# EAGLE design DCMv3 (EAGLE 9.4.2)
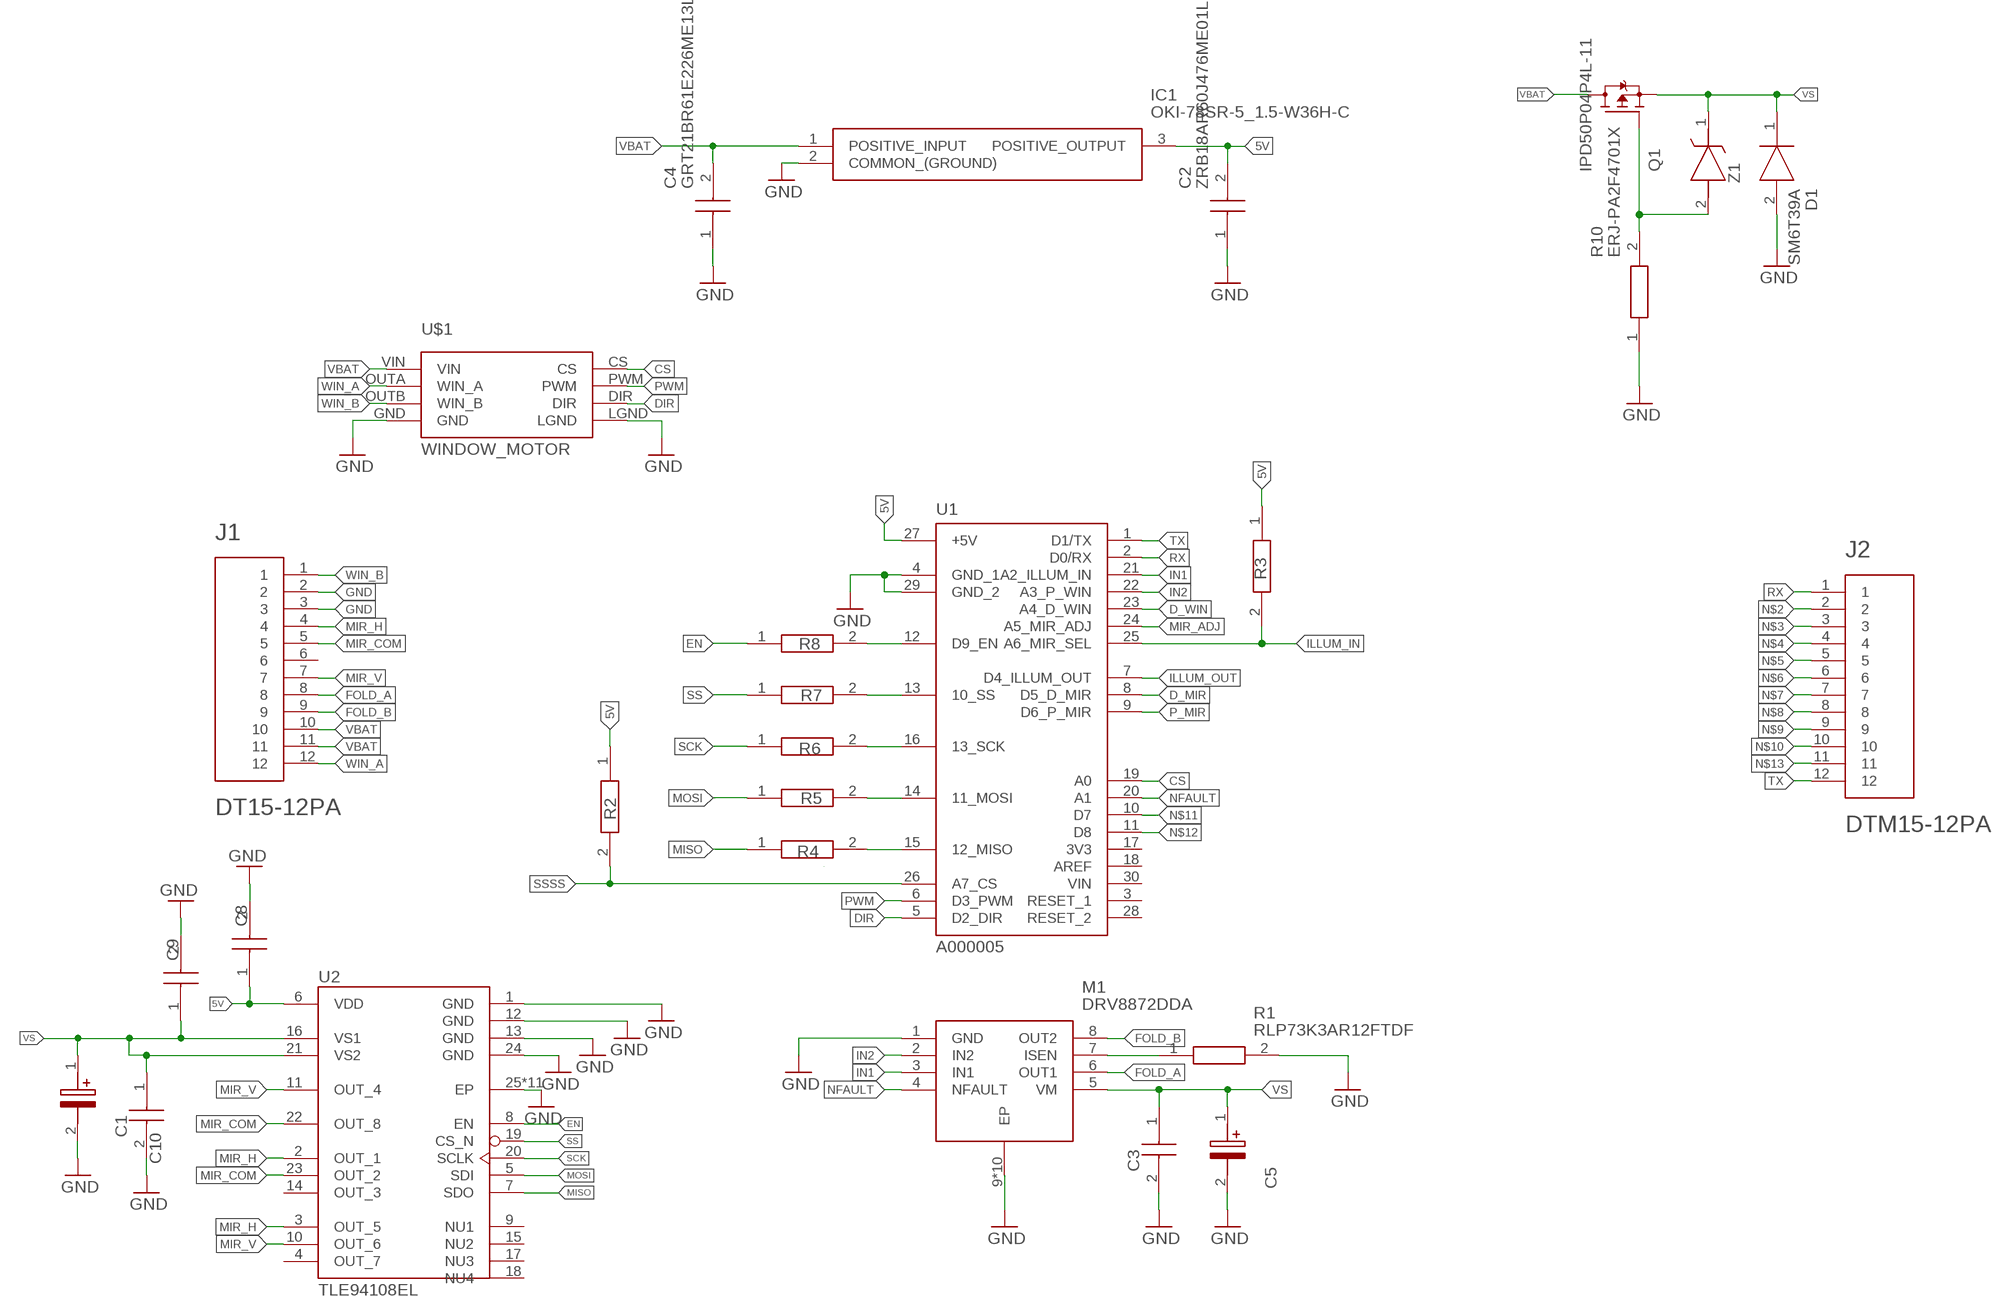
[diagram p0: schematic, sheet 1]

## Parts
C1  EEE-FT1H470AP  [CAPAE660X610N]
C2  ZRB18AR60J476ME01L  [CAPC1608X120N]
C3  GRM033R6YA104KE14D  [CAPC0603X33N]
C4  GRT21BR61E226ME13L  [CAPC2012X145N]
C5  EEE-FT1H470AP  [CAPAE660X610N]
C8  GRM155R61H104JE14D  [CAPC1005X55N]
C9  GRM155R61H104JE14D  [CAPC1005X55N]
C10  GRM155R61H104JE14D  [CAPC1005X55N]
D1  SM6T39A  [DIOM5436X265N]
IC1  OKI-78SR-5_1.5-W36H-C  [OKI-78SR-HORIZONTAL]
J1  DT15-12PA  [TE_DT15-12PA]
J2  DTM15-12PA  [TE_DTM15-12PA]
M1  DRV8872DDA  [SOIC127P600X170-9N]
Q1  IPD50P04P4L-11  [DPAK228P998X235-3N]
R1  RLP73K3AR12FTDF  [RESC6432X84N]
R2  ERJ-1RHD2202C  [RESC0603X26N]
R3  ERJ-1RHD2202C  [RESC0603X26N]
R4  ERJ-1RKD4700C  [RESC0603X26N]
R5  ERJ-1RKD4700C  [RESC0603X26N]
R6  ERJ-1RKD4700C  [RESC0603X26N]
R7  ERJ-1RKD4700C  [RESC0603X26N]
R8  ERJ-1RKD4700C  [RESC0603X26N]
R10  ERJ-PA2F4701X  [RESC1005X40N]
U1  A000005  [ARDUINO_A000005]
U2  TLE94108EL  [SOP65P600X170-25N]
U$1  WINDOW_MOTOR  [POLOLU]
Z1  MM3Z12VT1G  [SOD2512X110N]

## Nets
5V: C2.2 C8.1 IC1.3(POSITIVE_OUTPUT) R2.1 R3.1 U1.27(+5V) U2.6(VDD)
A_EN: R8.2 U1.12(D9_EN)
A_MISO: R4.2 U1.15(12_MISO)
A_MOSI: R5.2 U1.14(11_MOSI)
A_SCK: R6.2 U1.16(13_SCK)
A_SS: R7.2 U1.13(10_SS)
CS: U1.19(A0) U$1.CS
D_MIR: U1.8(D5_D_MIR)
D_WIN: U1.23(A4_D_WIN)
DIR: U1.5(D2_DIR) U$1.DIR
EN: R8.1 U2.8(EN)
FOLD_A: J1.8 M1.6(OUT1)
FOLD_B: J1.9 M1.8(OUT2)
GATE: Q1.1(G) R10.2 Z1.2(A)
GND: C1.2(-) C2.1 C3.2 C4.1 C5.2(-) C8.2 C9.2 C10.2 D1.2(A) IC1.2(COMMON_(GROUND)) J1.2 J1.3 M1.1(GND) M1.9(EP) M1.P$1(EP) M1.P$2(EP) M1.P$3(EP) M1.P$4(EP) M1.P$5(EP) M1.P$6(EP) M1.P$7(EP) M1.P$8(EP) M1.P$9(EP) R1.2 R10.1 U1.4(GND_1) U1.29(GND_2) U2.1(GND) U2.12(GND) U2.13(GND) U2.24(GND) U2.25(EP) U2.GND1(EP) U2.GND2(EP) U2.GND3(EP) U2.GND4(EP) U2.GND5(EP) U2.GND6(EP) U2.GND7(EP) U2.GND8(EP) U2.GND9(EP) U2.GND(EP) U$1.GND U$1.LGND
ILLUM_IN: R3.2 U1.25(A6_MIR_SEL)
ILLUM_OUT: U1.7(D4_ILLUM_OUT)
IN1: M1.3(IN1) U1.21(A2_ILLUM_IN)
IN2: M1.2(IN2) U1.22(A3_P_WIN)
ISEN: M1.7(ISEN) R1.1
MIR_ADJ: U1.24(A5_MIR_ADJ)
MIR_COM: J1.5 U2.22(OUT_8) U2.23(OUT_2)
MIR_H: J1.4 U2.2(OUT_1) U2.3(OUT_5)
MIR_V: J1.7 U2.10(OUT_6) U2.11(OUT_4)
MISO: R4.1 U2.7(SDO)
MOSI: R5.1 U2.5(SDI)
N$2: J2.2
N$3: J2.3
N$4: J2.4
N$5: J2.5
N$6: J2.6
N$7: J2.7
N$8: J2.8
N$9: J2.9
N$10: J2.10
N$11: U1.10(D7)
N$12: U1.11(D8)
N$13: J2.11
NFAULT: M1.4(NFAULT) U1.20(A1)
P_MIR: U1.9(D6_P_MIR)
PWM: U1.6(D3_PWM) U$1.PWM
RX: J2.1 U1.2(D0/RX)
SCK: R6.1 U2.20(SCLK)
SS: R7.1 U2.19(CS_N)
SSSS: R2.2 U1.26(A7_CS)
TX: J2.12 U1.1(D1/TX)
VBAT: C4.2 IC1.1(POSITIVE_INPUT) J1.10 J1.11 Q1.2(D) U$1.VIN
VS: C1.1(+) C3.1 C5.1(+) C9.1 C10.1 D1.1(K) M1.5(VM) Q1.3(S) U2.16(VS1) U2.21(VS2) Z1.1(K)
WIN_A: J1.12 U$1.OUTA(WIN_A)
WIN_B: J1.1 U$1.OUTB(WIN_B)
Unconnected: J1.6 U1.3(RESET_1) U1.17(3V3) U1.18(AREF) U1.28(RESET_2) U1.30(VIN) U2.4(OUT_7) U2.9(NU1) U2.14(OUT_3) U2.15(NU2) U2.17(NU3) U2.18(NU4)

## Library data of the parts
C1 C5 = SamacSys_Parts:EEE-FT1H470AP: Aluminum Electrolytic Capacitors - SMD 47uF 50volts 6.3x5.8mm SMD Source: Datasheet <https://componentsearchengine.com/Datasheets/1/EEE-FT1H470AP.pdf>; DESCRIPTION: Aluminum Electrolytic Capacitors - SMD 47uF 50volts 6.3x5.8mm SMD; HEIGHT: 6.1mm; MANUFACTURER_NAME: Panasonic; MANUFACTURER_PART_NUMBER: EEE-FT1H470AP; MOUSER_PART_NUMBER: 667-EEE-FT1H470AP; MOUSER_PRICE-STOCK: https://www.mouser.com/Search/Refine.aspx?Keyword=667-EEE-FT1H470AP
C2 = SamacSys_Parts:ZRB18AR60J476ME01L: Murata 0603 B 47uF Ceramic Multilayer Capacitor, 6.3 V dc, +85C, X5R Dielectric, +/-20% Source: Datasheet <https://componentsearchengine.com/Datasheets/1/ZRB18AR60J476ME01L.pdf>; DESCRIPTION: Murata 0603 B 47uF Ceramic Multilayer Capacitor, 6.3 V dc, +85C, X5R Dielectric, +/-20%; HEIGHT: 1.2mm; MANUFACTURER_NAME: Murata Electronics; MANUFACTURER_PART_NUMBER: ZRB18AR60J476ME01L; MOUSER_PART_NUMBER: 81-ZRB18AR60J476ME1L; MOUSER_PRICE-STOCK: https://www.mouser.com/Search/Refine.aspx?Keyword=81-ZRB18AR60J476ME1L
C3 = SamacSys_Parts:GRM033R6YA104KE14D: Multilayer Ceramic Capacitors MLCC - SMD/SMT 0201 0.10uF 35volts *Derate Voltage/Temp Source: Datasheet <https://componentsearchengine.com/Datasheets/1/GRM033R6YA104KE14D.pdf>; DESCRIPTION: Multilayer Ceramic Capacitors MLCC - SMD/SMT 0201 0.10uF 35volts *Derate Voltage/Temp; HEIGHT: 0.33mm; MANUFACTURER_NAME: Murata Electronics; MANUFACTURER_PART_NUMBER: GRM033R6YA104KE14D; MOUSER_PART_NUMBER: 81-GRM33R6YA104KE14D; MOUSER_PRICE-STOCK: https://www.mouser.com/Search/Refine.aspx?Keyword=81-GRM33R6YA104KE14D
C4 = SamacSys_Parts:GRT21BR61E226ME13L: Multilayer Ceramic Capacitors MLCC - SMD/SMT 0805 25Vdc 22uF X5R 20% Source: Datasheet <https://componentsearchengine.com/Datasheets/1/GRT21BR61E226ME13L.pdf>; DESCRIPTION: Multilayer Ceramic Capacitors MLCC - SMD/SMT 0805 25Vdc 22uF X5R 20%; HEIGHT: 1.45mm; MANUFACTURER_NAME: Murata Electronics; MANUFACTURER_PART_NUMBER: GRT21BR61E226ME13L; MOUSER_PART_NUMBER: 81-GRT21BR61E226ME3L; MOUSER_PRICE-STOCK: https://www.mouser.com/Search/Refine.aspx?Keyword=81-GRT21BR61E226ME3L
C8-C10 = SamacSys_Parts:GRM155R61H104JE14D: Multilayer Ceramic Capacitors MLCC - SMD/SMT Source: Datasheet <http://www.mouser.com/datasheet/2/281/murata_03052018_GRM_Series_1-1310166.pdf>; DESCRIPTION: Multilayer Ceramic Capacitors MLCC - SMD/SMT; HEIGHT: 0.55mm; MANUFACTURER_NAME: Murata Electronics; MANUFACTURER_PART_NUMBER: GRM155R61H104JE14D; MOUSER_PART_NUMBER: 81-GRM155R61H104JE4D; MOUSER_PRICE-STOCK: https://www.mouser.com/Search/Refine.aspx?Keyword=81-GRM155R61H104JE4D
D1 = SamacSys_Parts:SM6T39A: TVS Diode Uni-Directional SM6T39A 69.7V, 600W, SMB 2-Pin Source: Datasheet <https://componentsearchengine.com/Datasheets/1/SM6T39A.pdf>; DESCRIPTION: TVS Diode Uni-Directional SM6T39A 69.7V, 600W, SMB 2-Pin; HEIGHT: 2.65mm; MANUFACTURER_NAME: STMicroelectronics; MANUFACTURER_PART_NUMBER: SM6T39A; MOUSER_PART_NUMBER: 511-SM6T39A; MOUSER_PRICE-STOCK: https://www.mouser.com/Search/Refine.aspx?Keyword=511-SM6T39A
IC1 = SamacSys_Parts:OKI-78SR-5_1.5-W36H-C: Switching Regulator 7-36Vin 5Vo 1.5A Non-Isolated DC-DC Converter, 5V dc Output, 1.5A Source: Datasheet <https://componentsearchengine.com/Datasheets/1/OKI-78SR-5_1.5-W36H-C.pdf>; DESCRIPTION: Switching Regulator 7-36Vin 5Vo 1.5A Non-Isolated DC-DC Converter, 5V dc Output, 1.5A; HEIGHT: mm; MANUFACTURER_NAME: Murata Electronics; MANUFACTURER_PART_NUMBER: OKI-78SR-5/1.5-W36H-C; MOUSER_PART_NUMBER: 580-OKI78SR51.5W36HC; MOUSER_PRICE-STOCK: https://www.mouser.com/Search/Refine.aspx?Keyword=580-OKI78SR51.5W36HC
J1 = DT15-12PA:DT15-12PA: DEUTSCH Automotive; DT RECP ASM; AVAILABILITY: In stock; DESCRIPTION: DEUTSCH Automotive; DT RECP ASM; MF: TE Connectivity; MPN: DT15-12PA; PARTREV: C3; STANDARD: Manufacturer recommendation
J2 = DTM15-12PA:DTM15-12PA: DEUTSCH Automotive; DTM RECP ASM; AVAILABILITY: In stock; DESCRIPTION: DEUTSCH Automotive; DTM RECP ASM; MF: TE Connectivity; MPN: DTM15-12PA; PARTREV: B; STANDARD: Manufacturer recommendation
M1 = SamacSys_Parts:DRV8872DDA: Automotive 3.6-A Brushed DC Motor Driver With Fault Reporting Source: Datasheet <http://www.ti.com/lit/ds/symlink/drv8872-q1.pdf>; DESCRIPTION: Automotive 3.6-A Brushed DC Motor Driver With Fault Reporting; HEIGHT: 1.7mm; MANUFACTURER_NAME: Texas Instruments; MANUFACTURER_PART_NUMBER: DRV8872DDA; MOUSER_PART_NUMBER: 595-DRV8872DDA; MOUSER_PRICE-STOCK: https://www.mouser.com/Search/Refine.aspx?Keyword=595-DRV8872DDA
Q1 = IPD50P04P4L-11:IPD50P04P4L-11: P-Channel 40 V 10.6 mOhm OptiMOS®-P2 Power-Transistor -PG-TO-252-3; AVAILABILITY: Unavailable; DESCRIPTION: P-Channel 40 V 10.6 mOhm OptiMOS®-P2 Power-Transistor -PG-TO-252-3; MF: Infineon Technologies; MP: IPD50P04P4L-11; PACKAGE: TO-252-3 Infineon; PRICE: None
R1 = SamacSys_Parts:RLP73K3AR12FTDF: RES 0.12 OHM 1% 2W 2512 Source: Datasheet <http://www.te.com/commerce/DocumentDelivery/DDEController?Action=srchrtrv&DocNm=1773269&DocType=DS&DocLang=English>; DESCRIPTION: RES 0.12 OHM 1% 2W 2512; HEIGHT: 0.84mm; MANUFACTURER_NAME: TE Connectivity Passive Product; MANUFACTURER_PART_NUMBER: RLP73K3AR12FTDF
R2 R3 = SamacSys_Parts:ERJ-1RHD2202C: Thick Film Resistors - SMD 0201 chip resistor Source: Datasheet <https://mouser.componentsearchengine.com/Datasheets/1/ERJ-1RHD2202C.pdf>; DESCRIPTION: Thick Film Resistors - SMD 0201 chip resistor; HEIGHT: 0.26mm; MANUFACTURER_NAME: Panasonic; MANUFACTURER_PART_NUMBER: ERJ-1RHD2202C
R4-R8 = SamacSys_Parts:ERJ-1RKD4700C: 470 ohm Thick Film Resistors - SMD 0201 chip resistor Source: Datasheet <https://www.mouser.com/datasheet/2/315/AOA0000C304-1149620.pdf>; DESCRIPTION: 470 ohm Thick Film Resistors - SMD 0201 chip resistor; HEIGHT: 0.26mm; MANUFACTURER_NAME: Panasonic; MANUFACTURER_PART_NUMBER: ERJ-1RKD4700C
R10 = SamacSys_Parts:ERJ-PA2F4701X: Res Thick Film 0402 4.7K Ohm 1% 0.2W(1/5W) +/-100ppm/C Pad SMD Automotive T/R Source: Datasheet <https://www.arrow.com/en/products/erj-pa2f4701x/panasonic>; DESCRIPTION: Res Thick Film 0402 4.7K Ohm 1% 0.2W(1/5W) +/-100ppm/C Pad SMD Automotive T/R; HEIGHT: 0.4mm; MANUFACTURER_NAME: Panasonic; MANUFACTURER_PART_NUMBER: ERJ-PA2F4701X
U1 = A000005:A000005: MICRO, ARDUINO NANO 3.0, MINI-B USB, ATmega328, 0.1"DIP, ICSP HDR; AVAILABILITY: Unavailable; DESCRIPTION: MICRO, ARDUINO NANO 3.0, MINI-B USB, ATmega328, 0.1DIP, ICSP HDR; MF: Arduino; MP: A000005; PACKAGE: None; PRICE: None
U2 = TLE94108EL:TLE94108EL: TLE94108EL Protected Eight-Fold Half-Bridge Driver SOP65P600X170-25N
U$1 = Marvelous:WINDOW_MOTOR
Z1 = SamacSys_Parts:MM3Z12VT1G: ON Semiconductor MM3Z12VT1G Zener Diode, 12V 5% 0.2 W SMT 2-Pin SOD-323 Source: Datasheet <https://componentsearchengine.com/Datasheets/1/MM3Z12VT1G.pdf>; DESCRIPTION: ON Semiconductor MM3Z12VT1G Zener Diode, 12V 5% 0.2 W SMT 2-Pin SOD-323; HEIGHT: 1.1mm; MANUFACTURER_NAME: ON Semiconductor; MANUFACTURER_PART_NUMBER: MM3Z12VT1G; MOUSER_PART_NUMBER: 863-MM3Z12VT1G; MOUSER_PRICE-STOCK: https://www.mouser.com/Search/Refine.aspx?Keyword=863-MM3Z12VT1G

## Board
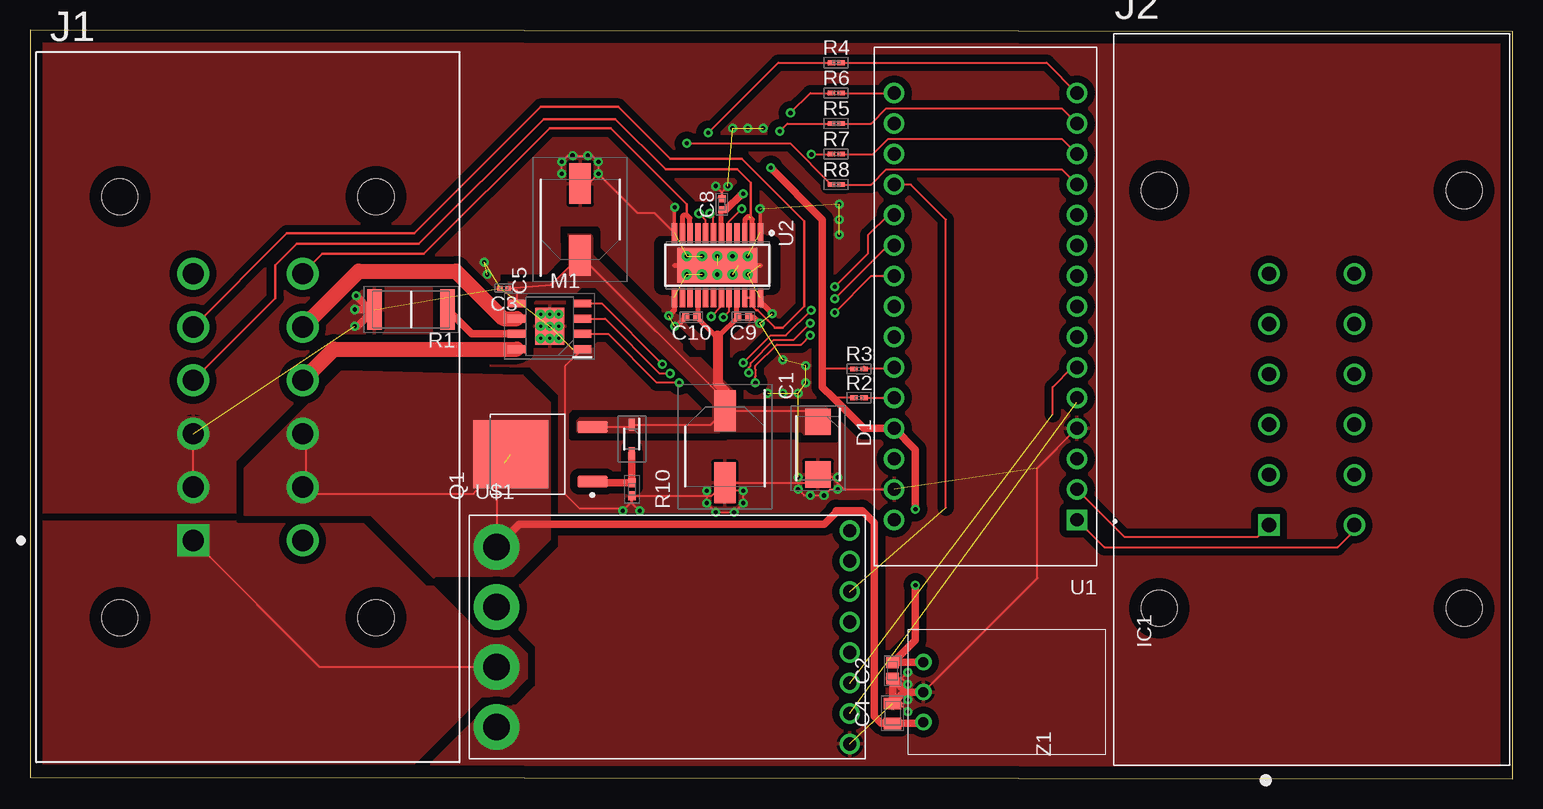
[diagram p1: board, top side]
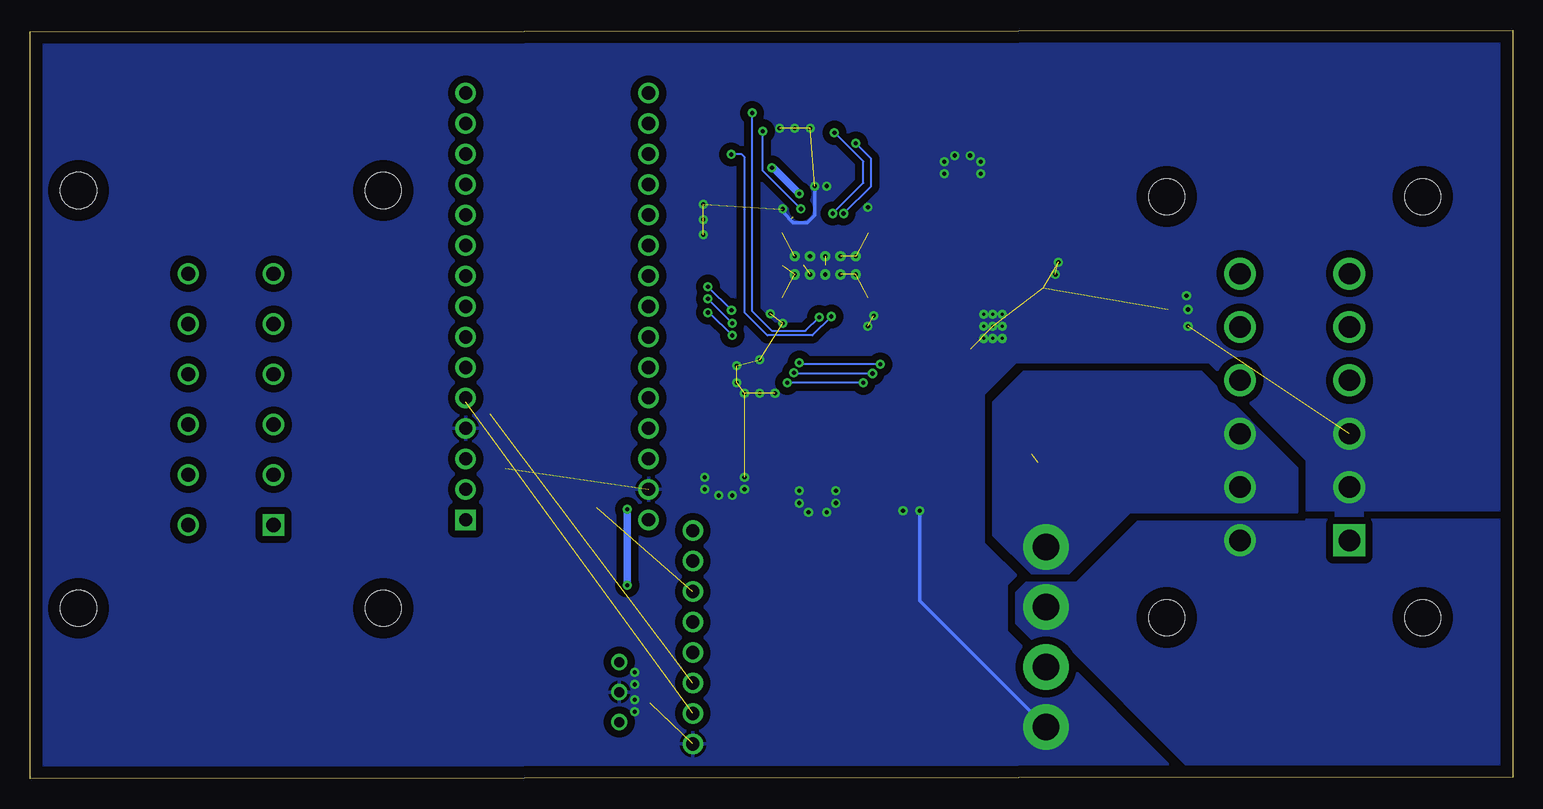
[diagram p2: board, bottom side, seen from below]

Size 123.55 x 62.41 mm. Coordinates in mm from the lower left corner, seen from the top.
Outline: 0,0.13 123.55,0 123.55,62.28 0,62.41 0,0.13
Copper layers (1*16): Top 0.035mm / dielectric 1.5mm / Bottom 0.035mm
Design rules "default": minimum track width 6mil, minimum drill 0.35mm, track to track 6mil, track to pad 6mil, pad to pad 6mil, via to via 6mil, smd to smd 6mil, copper to edge 40mil, drill to drill 6mil, minimum pad ring 10mil, minimum via ring 8mil, stop-mask expansion 4mil, vias tented up to drill 0mil, thermal gap 10mil
tRestrict: 4 lines

### Footprints (pad centres in the part's own frame; a part is rotated, then mirrored left to right if it is on the bottom)
CAPAE660X610N = smd 3.4 x 1.8: 1 -3,0; 2 3,0
CAPC1608X120N = smd 0.93 x 1.02: 1 -0.65,0; 2 0.65,0
CAPC0603X33N = smd 0.46 x 0.42: 1 -0.33,0; 2 0.33,0
CAPC2012X145N = smd 0.97 x 1.47: 1 -0.83,0; 2 0.83,0
CAPC1005X55N = smd 0.6 x 0.62: 1 -0.46,0; 2 0.46,0
DIOM5436X265N = smd 2.2 x 2.15: 1 -2.2,0; 2 2.2,0
OKI-78SR-HORIZONTAL = drill 0.835 pad 1.252: 1 2.5,-6.95; 2 0,-6.95; 3 -2.5,-6.95
TE_DT15-12PA = drill 1.77 square: 1 -4.56,-11.115 | drill 1.77: 2 -4.56,-6.67; 3 -4.56,-2.225; 4 -4.56,2.225; 5 -4.56,6.67; 6 -4.56,11.115; 7 4.56,11.115; 8 4.56,6.67; 9 4.56,2.225; 10 4.56,-2.225; 11 4.56,-6.67; 12 4.56,-11.115 | hole 2.99: -10.67,17.535; 10.67,17.535; 10.67,-17.545; -10.67,-17.545
TE_DTM15-12PA = drill 1.19 square: 1 -10.475,3.555 | drill 1.19: 2 -6.285,3.555; 3 -2.095,3.555; 4 2.095,3.555; 5 6.285,3.555; 6 10.475,3.555; 7 10.475,-3.555; 8 6.285,-3.555; 9 2.095,-3.555; 10 -2.095,-3.555; 11 -6.285,-3.555; 12 -10.475,-3.555 | hole 2.99: -17.41,-12.7; -17.41,12.7; 17.41,12.7; 17.41,-12.7
SOIC127P600X170-9N = smd 1.525 x 0.65: 1 -2.712,1.905; 2 -2.712,0.635; 3 -2.712,-0.635; 4 -2.712,-1.905; 5 2.712,-1.905; 6 2.712,-0.635; 7 2.712,0.635; 8 2.712,1.905 | smd 2.4 x 3.1: 9 0,0 | drill 0.25 pad 0.61: P$1 -0.762,1.016; P$2 -0.762,0; P$3 -0.762,-1.016; P$4 0,-1.016; P$5 0,0; P$6 0,1.016; P$7 0.762,1.016; P$8 0.762,0; P$9 0.762,-1.016
DPAK228P998X235-3N = smd 0.94 x 2.52: 1 -2.28,-4.34; 3 2.28,-4.34 | smd 5.67 x 6.23: 2 0,2.48
RESC6432X84N = smd 1.2 x 3.35: 1 -3.05,0; 2 3.05,0
RESC0603X26N = smd 0.625 x 0.4: 1 -0.412,0; 2 0.412,0
RESC1005X40N = smd 0.75 x 0.65: 1 -0.55,0; 2 0.55,0
ARDUINO_A000005 = drill 1.1 pad 1.7 square: 1 -7.62,17.78 | drill 1.1 pad 1.7: 2 -7.62,15.24; 3 -7.62,12.7; 4 -7.62,10.16; 5 -7.62,7.62; 6 -7.62,5.08; 7 -7.62,2.54; 8 -7.62,0; 9 -7.62,-2.54; 10 -7.62,-5.08; 11 -7.62,-7.62; 12 -7.62,-10.16; 13 -7.62,-12.7; 14 -7.62,-15.24; 15 -7.62,-17.78; 16 7.62,-17.78; 17 7.62,-15.24; 18 7.62,-12.7; 19 7.62,-10.16; 20 7.62,-7.62; 21 7.62,-5.08; 22 7.62,-2.54; 23 7.62,0; 24 7.62,2.54; 25 7.62,5.08; 26 7.62,7.62; 27 7.62,10.16; 28 7.62,12.7; 29 7.62,15.24; 30 7.62,17.78
SOP65P600X170-25N = smd 1.6 x 0.457: 1 -2.692,3.581; 2 -2.692,2.921; 3 -2.692,2.286; 4 -2.692,1.626; 5 -2.692,0.965; 6 -2.692,0.33; 7 -2.692,-0.33; 8 -2.692,-0.965; 9 -2.692,-1.626; 10 -2.692,-2.286; 11 -2.692,-2.921; 12 -2.692,-3.581; 13 2.692,-3.581; 14 2.692,-2.921; 15 2.692,-2.286; 16 2.692,-1.626; 17 2.692,-0.965; 18 2.692,-0.33; 19 2.692,0.33; 20 2.692,0.965; 21 2.692,1.626; 22 2.692,2.286; 23 2.692,2.921; 24 2.692,3.581 | smd 2.896 x 6.655: 25 0,0 | drill 0.35: GND -0.762,2.54; GND1 0.762,2.54; GND2 -0.762,1.27; GND3 0.762,1.27; GND4 -0.762,0; GND5 0.762,0; GND6 -0.762,-1.27; GND7 0.762,-1.27; GND8 -0.762,-2.54; GND9 0.762,-2.54
POLOLU = drill 1.1 pad 1.7: 3V3 15.23,6.34; CS 15.23,3.8; DIR 15.23,-6.36; FLT 15.23,1.26; LGND 15.23,-8.9; PWM 15.23,-3.82; SLP 15.23,-1.28; VM 15.23,8.88 | drill 2.184 pad 3.81: GND -14.21,-7.49; OUTA -14.21,2.51; OUTB -14.21,-2.49; VIN -14.21,7.51
SOD2512X110N = smd 1 x 0.5: 1 -1.2,0; 2 1.2,0

### Placement (x,y rotation side)
C1  57.91,27.69 270 top
C2  71.88,9.02 90 top
C3  39.5,40.89 180 top
C4  71.88,5.46 270 top
C5  45.85,46.61 90 top
C8  57.66,47.88 90 top
C9  59.44,38.48 0 top
C10  55.12,38.48 180 top
D1  65.66,27.56 270 top
IC1  81.41,7.24 270 top
J1  18.16,30.99 0 top
J2  106.81,31.62 90 top
M1  43.31,37.72 180 top
Q1  42.55,27.05 90 top
R1  31.75,39.12 180 top
R2  69.09,31.75 0 top
R3  69.09,34.16 0 top
R4  67.18,59.69 0 top
R5  67.18,54.61 0 top
R6  67.18,57.15 0 top
R7  67.18,52.07 0 top
R8  67.18,49.53 0 top
R10  50.16,24.13 90 top
U1  79.63,39.37 180 top
U2  57.28,42.8 270 top
U$1  53.09,11.81 0 top
Z1  50.16,28.32 270 top

### Tracks (layer width: path | path; a pad name or v marks a point on that pad's centre or on a via)
5V  (via drill 0.35)
  Top 0.152: 71.95,9.74 C2.2 | 57.66,47.5 C8.1 | R3.1 66.17,34.16 66.04,34.29 | R2.1 66.93,31.75
  Top 0.406: U2.6 57.61,47.37 C8.1
  Top 0.61: IC1.3 71.95,9.74 73.79,11.57 v73.79,16.13 | v61.72,50.93 66.04,46.61 66.04,34.29 66.04,32.64 66.93,31.75 69.47,29.21 U1.27 73.79,27.43 v73.79,22.48 | v59.44,48.77 59.34,48.77 58,47.42 C8.1
  Bottom 0.61: v61.72,50.93 61.6,50.93 v59.44,48.77 | v73.79,22.48 v73.79,16.13
A_EN
  Top 0.152: R8.2 70.1,49.53 71.37,50.8 85.98,50.8 U1.12
A_MISO
  Top 0.152: R4.2 84.71,59.69 U1.15
A_MOSI
  Top 0.152: R5.2 70.1,54.61 71.37,55.88 85.98,55.88 U1.14
A_SCK
  Top 0.152: R6.2 U1.16
A_SS
  Top 0.152: R7.2 70.23,52.07 71.5,53.34 85.98,53.34 U1.13
CS  (1 unrouted)
  Top 0.152: 76.33,22.61 76.33,46.61 73.41,49.53 U1.19
DIR  (1 unrouted)
  Top 0.152: U1.5 87.25,31.37
EN  (via drill 0.35)
  Top 0.152: U2.8 56.31,46.56 v55.75,47.12 | v54.74,52.96 63.34,52.96 R8.1
  Bottom 0.152: v55.75,47.12 53.47,49.4 53.47,51.69 v54.74,52.96
FOLD_A
  Top 1.27: M1.6 39.44,38.35 35.48,42.31 27.38,42.31 J1.8
FOLD_B
  Top 1.27: J1.9 25.32,35.81 M1.8
GATE
  Top 0.152: Q1.1 46.98,24.68
  Top 0.61: 46.98,24.68 R10.2 Z1.2
GND  (via drill 0.35)  (32 unrouted)
  Top 0.152: R10.1 56.81,23.58 57.76,24.54 | 57.76,24.54 C1.2 64.99,24.69 D1.2 66.17,25.36 | U1.29 67.82,24.13 66.59,25.36 66.17,25.36 | 45.21,35.81 M1.1 44.58,34.37 44.58,23.75 45.78,22.54 49.59,22.54 | v73.15,8.89 72.63,8.37 C2.1 72.66,8.37 v73.15,7.87 | v73.15,5.59 72.45,6.29 C4.1 72.84,6.29 v73.15,6.6 | v57.15,49.4 57.66,48.9 | v58.17,49.4 57.66,48.9 | 57.66,48.9 C8.2 | v49.4,22.35 49.59,22.54 | 49.59,22.54 50.16,23.11 R10.1 | v50.8,22.35 50.16,22.99 R10.1 | J1.2 J1.3 | v44.32,50.42 v44.32,51.44 44.83,51.94 v45.21,51.94 v46.48,51.94 46.86,51.94 v47.37,51.44 v47.37,50.42 | v47.37,50.42 46.56,49.61 C5.2 | v47.37,50.42 50.65,47.14 52.05,47.14 U2.12 | 75.06,7.24 IC1.2 83.95,16.73 83.95,25.91 U1.4 | v56.39,24 v56.39,22.99 v57.15,22.22 v58.67,22.22 v59.44,22.99 v59.44,24 58.29,24 57.76,24.54 | v64.01,25.15 v64.01,24.13 64.52,23.62 v65.02,23.62 v66.17,23.62 66.67,24.13 v67.31,24.13 v67.31,25.15 66.38,25.15 66.17,25.36
  Top 0.305: U2.12 53.7,47.6 v53.72,47.62 | U2.1 60.86,47.47 v60.83,47.5
  Top 0.406: 59.05,42.8 U2.GND | U2.25 59.05,42.8 | 59.05,42.8 U2.GND1 | U2.25 57.79,42.8 U2.GND2 | U2.25 U2.GND5 | 56.77,42.8 U2.GND7 56.52,42.04 U2.25 | 53.7,42.8 60.86,42.8 | U2.25 56.77,42.8 | 56.77,42.8 U2.GND6 | U2.13 53.7,39.05 v53.24,38.59 | C9.2 60.33,38.48 v60.83,37.97 | C10.2 53.9,37.72 v53.72,37.72 | v61.85,38.76 60.86,39.75 U2.24
  Top 0.61: v27.18,40.26 28.32,39.12 R1.2 | R1.2 v27.05,39.12 | R1.2 27.3,37.72 v27.05,37.72 | C2.1 73.01,7.24 IC1.2 72.83,7.24 C4.1 C2.1
  Bottom 0.305: U$1.GND 49.4,14.85 v49.4,22.35 | v58.17,49.4 58.17,46.99 58.8,46.36 59.94,46.36 60.83,47.24 v60.83,47.5
  other vias: 37.85,43.05 38.1,42.04 58.55,54.23 59.82,54.23 61.09,54.23 67.44,47.88 67.44,46.61 67.44,45.34 61.47,32.13 62.74,32.13 64.01,32.13 64.64,33.02 62.74,34.93 64.64,34.42
  pour Top (no thermals): 61.6,44.32 53.09,44.32 53.09,41.28 61.47,41.28 61.6,41.4
  pour Bottom (no thermals): 61.6,44.45 52.96,44.45 52.96,41.02 61.47,41.02 61.6,41.15
  pour Bottom (isolate 0.61, rank 6): 0.13,-0.38 0.13,61.85 123.32,61.85 123.32,-0.38
  pour Top (isolate 0.61, rank 3): 0.13,0.89 0.13,61.85 123.32,61.85 123.32,0.89
  pour Top (no thermals): 10.29,30.1 16.64,30.1 16.64,22.48 10.29,22.48
  pour Top (no thermals): 36.45,4.19 38.23,5.97 40.77,5.97 42.04,4.7 42.04,3.43 40.77,2.16 36.45,2.16
  pour Bottom (no thermals): 11.56,30.61 11.56,22.48 15.37,22.48 15.37,30.61
  pour Bottom (no thermals): 35.81,6.6 42.04,6.6 42.42,6.22 42.42,1.78 42.16,1.52 36.2,1.52 35.94,1.78 35.94,6.48
  pour Top (no thermals): 53.72,45.47 53.72,46.86 52.2,46.86 52.2,45.21 52.32,45.34 53.72,45.34
  pour Top (no thermals): 60.83,45.47 62.1,45.47 62.1,46.86 60.83,46.86
  pour Top (no thermals): 53.72,40.13 52.71,40.13 52.71,38.99 53.72,38.99
  pour Top (no thermals): 60.96,40.13 61.85,40.13 61.85,39.24 60.96,39.24 60.83,39.37 60.83,40.13
  pour Bottom (no thermals): 49.4,43.56 52.2,43.56 52.32,43.43 52.32,42.67 52.2,42.55 49.53,42.55 49.53,43.43
  pour Top (no thermals): 44.96,35.81 47.37,35.81 47.37,34.54 44.83,34.54 44.83,35.69
ILLUM_IN
  Top 0.152: U1.25 71.88,34.16 R3.2 69.5,34.39
IN1  (via drill 0.35)
  Top 0.152: v53.34,33.78 52.5,33.78 47.92,38.35 M1.3 | v59.89,33.84 59.89,34.27 60.04,34.42 60.04,34.64 61.98,36.58 63.63,36.58 v65.02,37.97 | v67.06,40.01 71.5,44.45 U1.21
  Bottom 0.152: v53.34,33.78 59.83,33.78 v59.89,33.84 | v65.02,37.97 v67.06,40.01
IN2  (via drill 0.35)
  Top 0.152: v54.1,33.02 52.24,33.02 48.18,37.08 M1.2 | v60.45,33.02 60.45,33.54 60.5,33.59 60.5,34.09 60.45,34.13 60.45,34.42 62.23,36.2 64.26,36.2 v65.02,36.96 | v67.06,38.86 70.1,41.91 U1.22
  Bottom 0.152: v54.1,33.02 v60.45,33.02 | v65.02,36.96 66.93,38.86 v67.06,38.86
ISEN
  Top 0.61: M1.7 36.83,37.08 R1.1
MIR_COM
  Top 0.203: J1.5 21.41,45.47 32,45.47 42.55,56.01 49.02,56.01 53.34,51.69 59.31,51.69 64.52,46.48 64.52,39.37 62.74,37.59 62.1,37.59 | 62.08,37.59 62.1,37.59 | 62.1,37.59 61.47,38.23 60.65,39.05 60.53,39.05 60.2,39.38 U2.23 U2.22
  Top 0.406: 59.56,39.88 U2.22
MIR_H  (1 unrouted)
  Top 0.152: 20.45,42.8 22.22,44.58
  Top 0.203: J1.4 20.45,40.06 20.45,42.8 | 22.22,44.58 32.39,44.58 42.8,54.99 48.77,54.99 52.96,50.8 58.94,50.8 60.07,49.67 60.07,46.74
  Top 0.406: U2.2 60.2,46.61 60.07,46.74 | 59.94,46.86 59.82,46.86 59.56,46.61 U2.3
MIR_V
  Top 0.203: J1.7 24.37,43.75 32.83,43.75 43.31,54.23 48.39,54.23 54.74,47.88 54.74,46.99
  Top 0.406: U2.10 54.99,46.74 54.74,46.99 54.48,46.99 54.36,46.86 U2.11
MISO  (via drill 0.35)
  Top 0.152: U2.7 56.95,46.83 v56.66,47.12 | v56.52,53.85 62.36,59.69 R4.1
  Bottom 0.152: v56.66,47.12 54.1,49.68 54.1,51.47 56.48,53.85 v56.52,53.85
MOSI  (via drill 0.35)
  Top 0.152: U2.5 58.24,46.43 v59.31,47.5 | v62.48,53.98 63.12,54.61 R5.1
  Bottom 0.152: v59.31,47.5 62.48,50.67 v62.48,53.98
NFAULT  (via drill 0.35)
  Top 0.152: M1.4 47.62,39.62 v52.71,34.54 | v59.44,34.67 61.72,36.96 63,36.96 v65.09,39.05 | v67.06,41.02 69.85,43.82 69.85,45.34 71.5,46.99 U1.20
  Bottom 0.152: v52.71,34.54 59.31,34.54 v59.44,34.67 | v65.09,39.05 v67.06,41.02
PWM  (1 unrouted)
  Top 0.152: 85.22,30.38 85.22,32.64 86.87,34.29 U1.6
RX
  Top 0.152: U1.2 91.19,20.19 102.3,20.19 J2.1
SCK  (via drill 0.35)
  Top 0.152: U2.20 58.24,38.94 v57.79,38.48 | v63.37,55.5 65.02,57.15 R6.1
  Bottom 0.152: v57.79,38.48 58.93,37.34 61.72,37.34 63.37,38.99 v63.37,55.5
SS  (via drill 0.35)
  Top 0.152: U2.19 57.61,39.37 v56.77,38.53 | v65.12,52.04 66.74,52.04 R7.1
  Bottom 0.152: v56.77,38.53 58.34,36.96 62.1,36.96 64.01,38.86 64.01,51.82 64.23,52.04 v65.12,52.04
SSSS
  Top 0.152: R2.2 U1.26
TX
  Top 0.152: U1.1 89.53,19.3 108.97,19.3 109.98,20.32 109.98,20.95 110.49,20.95 110.49,21.02 J2.12
VBAT  (1 unrouted)
  Top 0.152: 38.88,25.67 U$1.VIN | 39.54,26.34 38.88,25.67 | J1.10 22.99,28.5 22.99,24.05 | 38.88,25.67 36.96,23.75 22.99,23.75 22.99,24.05 | J1.11 22.99,24.05 | IC1.1 74.35,4.63
  Top 0.61: 74.35,4.63 C4.2 70.93,4.63 70.36,5.21 70.36,21.34 69.34,22.35 67.18,22.35 67.18,22.22 66.17,21.21 40.76,21.21 U$1.VIN
  pour Top (isolate 0.61, no thermals): 17.91,25.91 26.01,34.01 41.03,33.64 43.31,31.37 43.31,19.94 40.26,16.89 33.78,16.89 33.66,16.76 28.45,21.97 17.91,21.97
  pour Bottom (isolate 0.61, rank 3, no thermals): 17.91,22.22 17.91,25.91 25.91,33.91 40.77,33.91 43.31,31.37 43.31,20.32 40.13,17.14 36.96,17.14 31.88,22.22
VS
  Top 0.152: Q1.3 49.98,29.33 Z1.1 56.75,29.52 C1.1 58.55,30.69 | 58.55,30.69 64.73,30.69 D1.1 | M1.5 40.6,40.74 C3.1 43.44,41.2 C5.1 58.55,30.91 58.55,30.69
  Top 0.406: U2.21 58.9,38.55 C9.1 57.53,37.04 57.53,36.96 | U2.16 55.65,38.56 C10.1 57.1,36.96 57.3,36.96
  Top 0.813: 57.3,36.96 57.3,32.95 57.91,32.34 C1.1
  pour Top (no thermals): 57.15,28.96 64.26,28.96 64.52,28.7 66.67,28.7 66.67,30.61 66.55,30.73 66.29,30.99 57.15,30.99 57.02,30.86 57.02,28.96
  pour Top (isolate 0.406, no thermals): 39.88,39.37 39.88,41.4 43.69,41.4 44.96,42.67 44.96,45.21 46.74,45.21 46.86,45.09 46.86,41.91 45.47,40.51 41.53,40.51 41.28,40.26 41.28,39.37
  pour Top (no thermals): 44.83,45.34 44.96,45.21 44.96,41.91 45.85,41.02 47.12,41.02 56.9,31.24 56.9,28.96 58.8,28.96 58.8,32.13 58.67,32.26 55.88,35.05 54.99,35.05 54.36,35.69 54.36,36.2 46.86,43.69 46.86,45.21 46.74,45.34
  pour Top (no thermals): 45.59,29.84 45.85,30.1 57.4,30.1 57.66,29.84 57.66,29.08 57.4,28.83 45.72,28.83 45.59,28.96
WIN_A
  pour Bottom (isolate 0.61, rank 4, no thermals): 0.38,1.14 0.38,21.59 31.5,21.59 36.58,16.51 40.39,16.51 41.4,15.49 41.4,12.95 40.01,11.56 37.59,11.56 27.18,1.14
WIN_B
  Top 0.152: U$1.OUTB 24.15,9.32 J1.1
  pour Top (isolate 0.61, rank 2, no thermals): 0.51,21.46 28.19,21.46 37.72,11.94 39.88,11.94 41.4,10.41 41.4,8.38 39.88,6.86 37.59,6.86 32,1.27 0.51,1.27